# EAGLE design UT-61E_BLB (EAGLE 7.1.0)
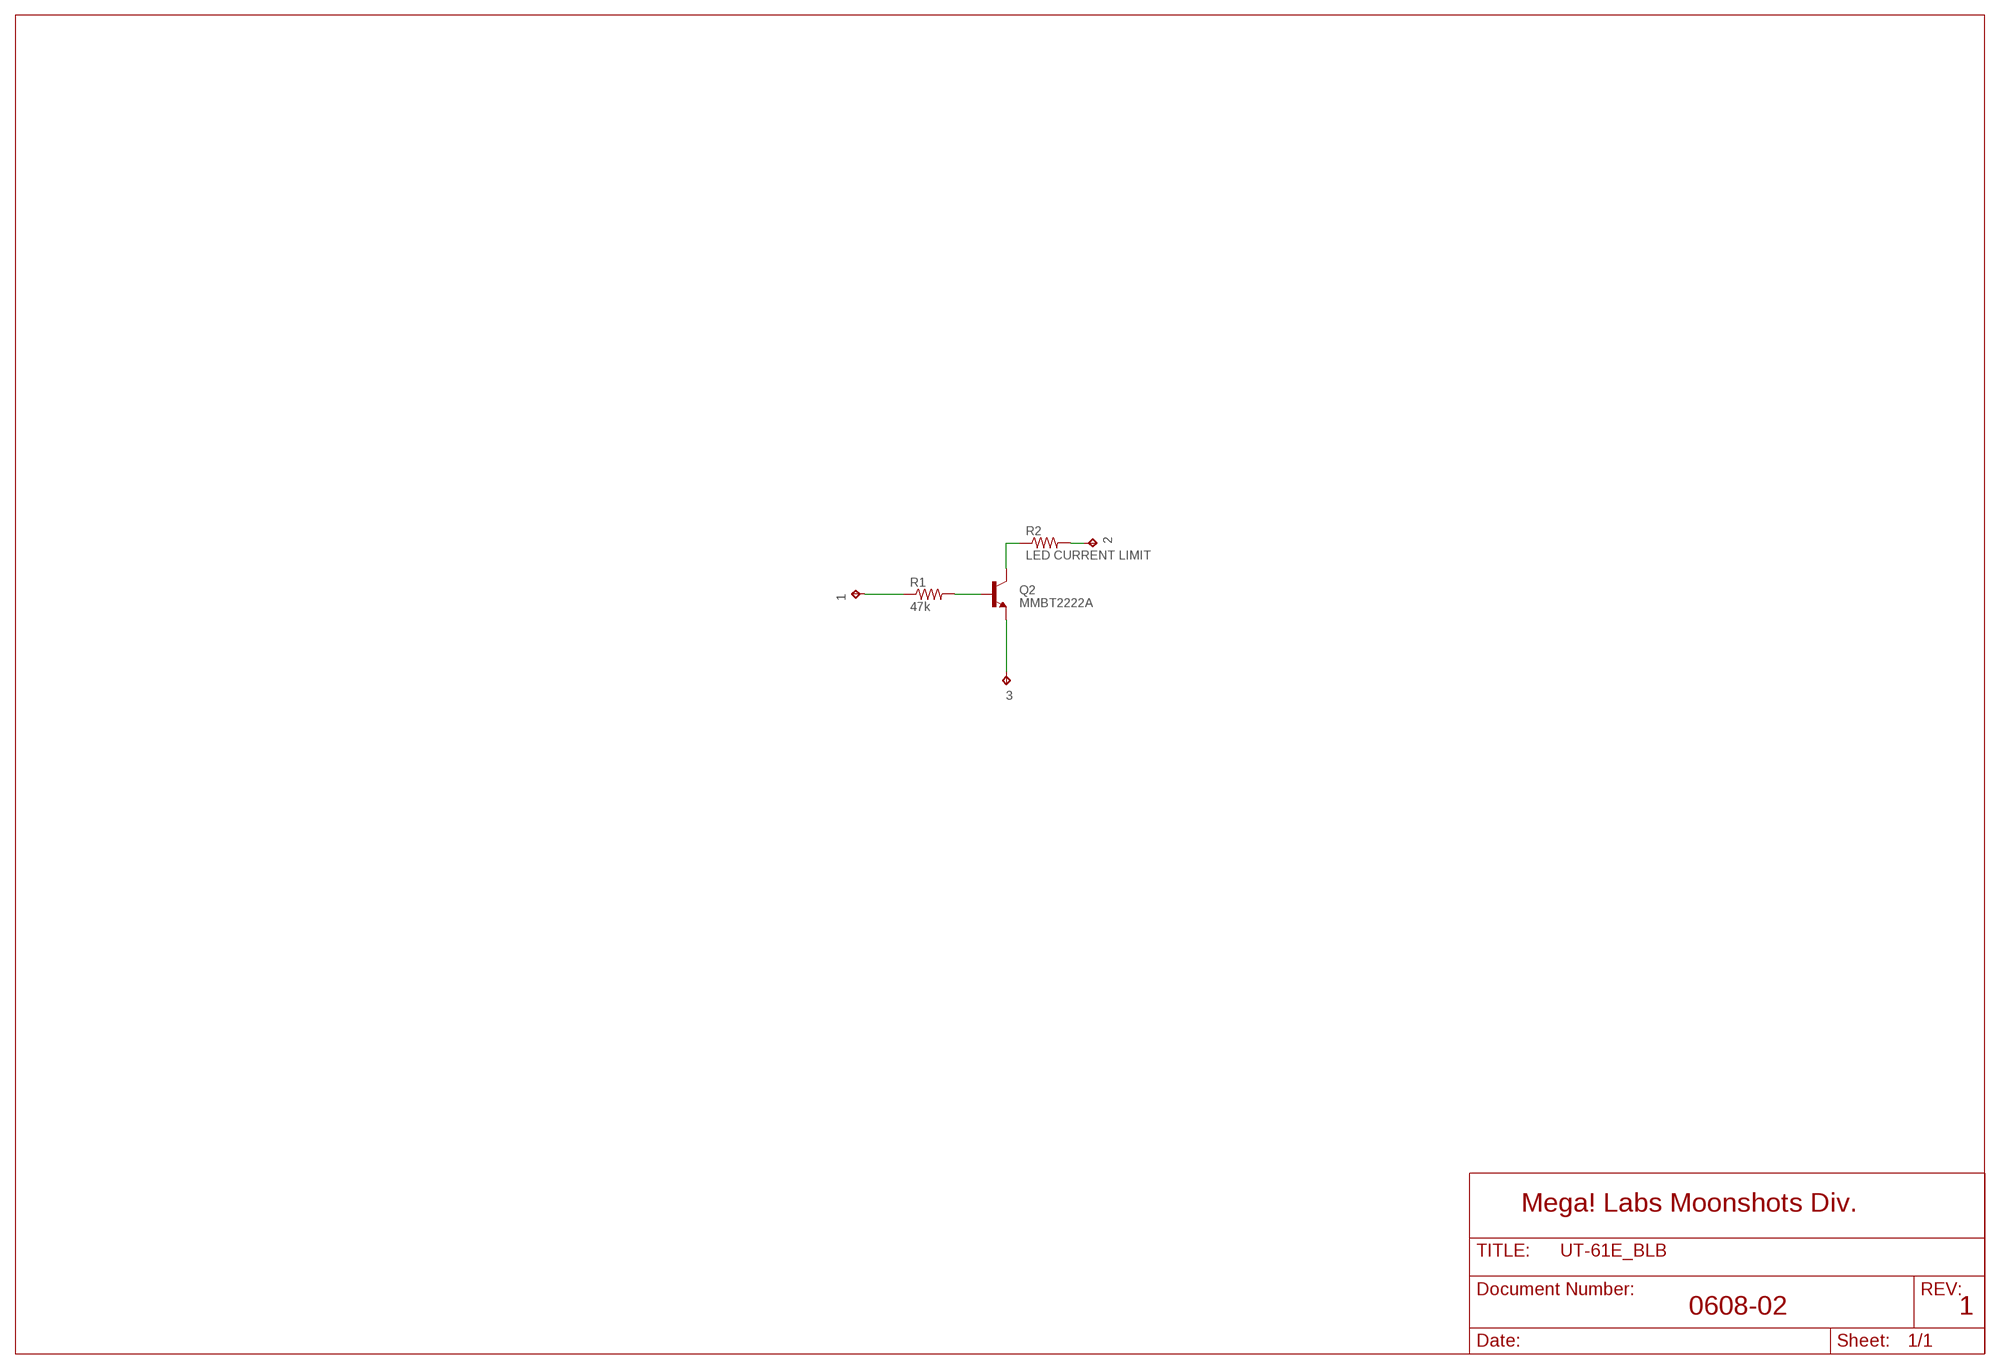
[diagram p0: schematic, sheet 1]

## Parts
1  TPTP18SQ  [TP18SQ]
2  TPTP18SQ  [TP18SQ]
3  TPTP18SQ  [TP18SQ]
Q2  MMBT2222A  TRANSISTOR_NPNMMBT2222A  [SOT23-3]
R1  47k  RESISTOR0805-RES  [0805]
R2  LED CURRENT LIMIT  RESISTOR0805-RES  [0805]

## Nets
GND: 3.TP Q2.2(E)
N$1: Q2.1(B) R1.2
N$2: 1.TP R1.1
N$3: Q2.3(C) R2.1
N$5: 2.TP R2.2

## Notes on the sheet
- Mega! Labs Moonshots Div.
- 0608-02 | 1

## Library data of the parts
1-3 = testpad:TP: Test pad
Q2 = SparkFun-DiscreteSemi:TRANSISTOR_NPN: Generic NPN BJT MMBT2222A - TRANS-08049 (SOT-23, 1A 40V) MPSA42 - TRANS-09116 (SOT-23, 500mA 300V) MMBT5088LT1G - TRANS-11160 (SOT-23, 50 mA 30V) BC547 - COM-08928 <http://www.sparkfun.com/products/8928> (TO-92 45V 100mA) (1.Collector 2.Base 3.Emitter) 2N3904 - COM-00521 <http://www.sparkfun.com/products/521> (TO-92 40V 200mA) (1.Emitter 2.Base 3.Collector) P2N2222A - COM-12852 <http://www.sparkfun.com/products/12852> (TO-92 40V 600mA) (1.Collector 2.Base 3.Emitter); PROD_ID: TRANS-08049
R1 R2 = SparkFun-Passives:RESISTOR: Resistor Basic schematic elements and footprints for 0603, 1206, and PTH resistors.

## Board
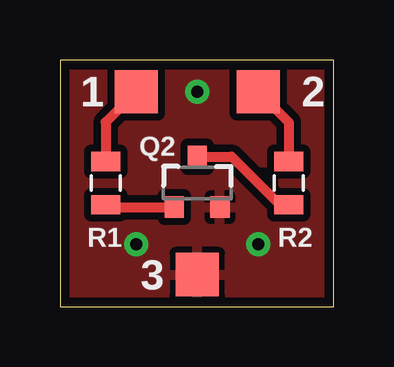
[diagram p1: board, top side]
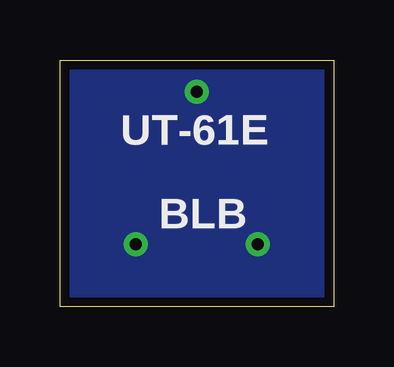
[diagram p2: board, bottom side, seen from below]

Size 11.41 x 10.27 mm. Coordinates in mm from the lower left corner, seen from the top.
Outline: 0,0 11.41,0 11.41,10.27 0,10.27 0,0
Copper layers (1*16): Top 0.0356mm / dielectric 1.5011mm / Bottom 0.0356mm
Design rules "LaenPCBOrder *": minimum track width 6mil, minimum drill 13mil, track to track 6mil, track to pad 6mil, pad to pad 6mil, via to via 6mil, smd to smd 6mil, copper to edge 15mil, drill to drill 6mil, minimum pad ring 7mil, minimum via ring 10mil, stop-mask expansion 3mil, vias tented up to drill 1.3mm, thermal gap 10mil

### Footprints (pad centres in the part's own frame; a part is rotated, then mirrored left to right if it is on the bottom)
TP18SQ = smd 1.8 x 1.8: TP 0,0
SOT23-3 = smd 0.8 x 0.9: 1 -0.95,-1; 2 0.95,-1; 3 0,1.1
0805 = smd 0.8 x 1.2: 1 -0.9,0; 2 0.9,0

### Placement (x,y rotation side)
1  3.17,8.95 0 top
2  8.26,8.95 0 top
3  5.71,1.33 0 top
Q2  5.71,5.14 0 top
R1  1.9,5.14 270 top
R2  9.53,5.14 90 top

### Tracks (layer width: path | path; a pad name or v marks a point on that pad's centre or on a via)
GND  (via drill 0.5)
  other vias: 3.17,2.6 8.26,2.6 5.71,8.95
  pour Bottom (isolate 0.305): 0,10.35 11.37,10.29 11.43,-0.06 0,0
  pour Top (isolate 0.305): 0,10.35 11.37,10.29 11.43,-0.06 0,0
N$1
  Top 0.406: R1.2 2,4.14 Q2.1
N$2
  Top 0.406: 1.TP 1.9,7.68 R1.1
N$3
  Top 0.406: R2.1 9.15,4.24 7.15,6.24 Q2.3
N$5
  Top 0.406: 2.TP 9.53,7.68 R2.2

### Text on the board
bNames: UT-61E | BLB